# EAGLE board cape-servitron-v1 (EAGLE 6.4)
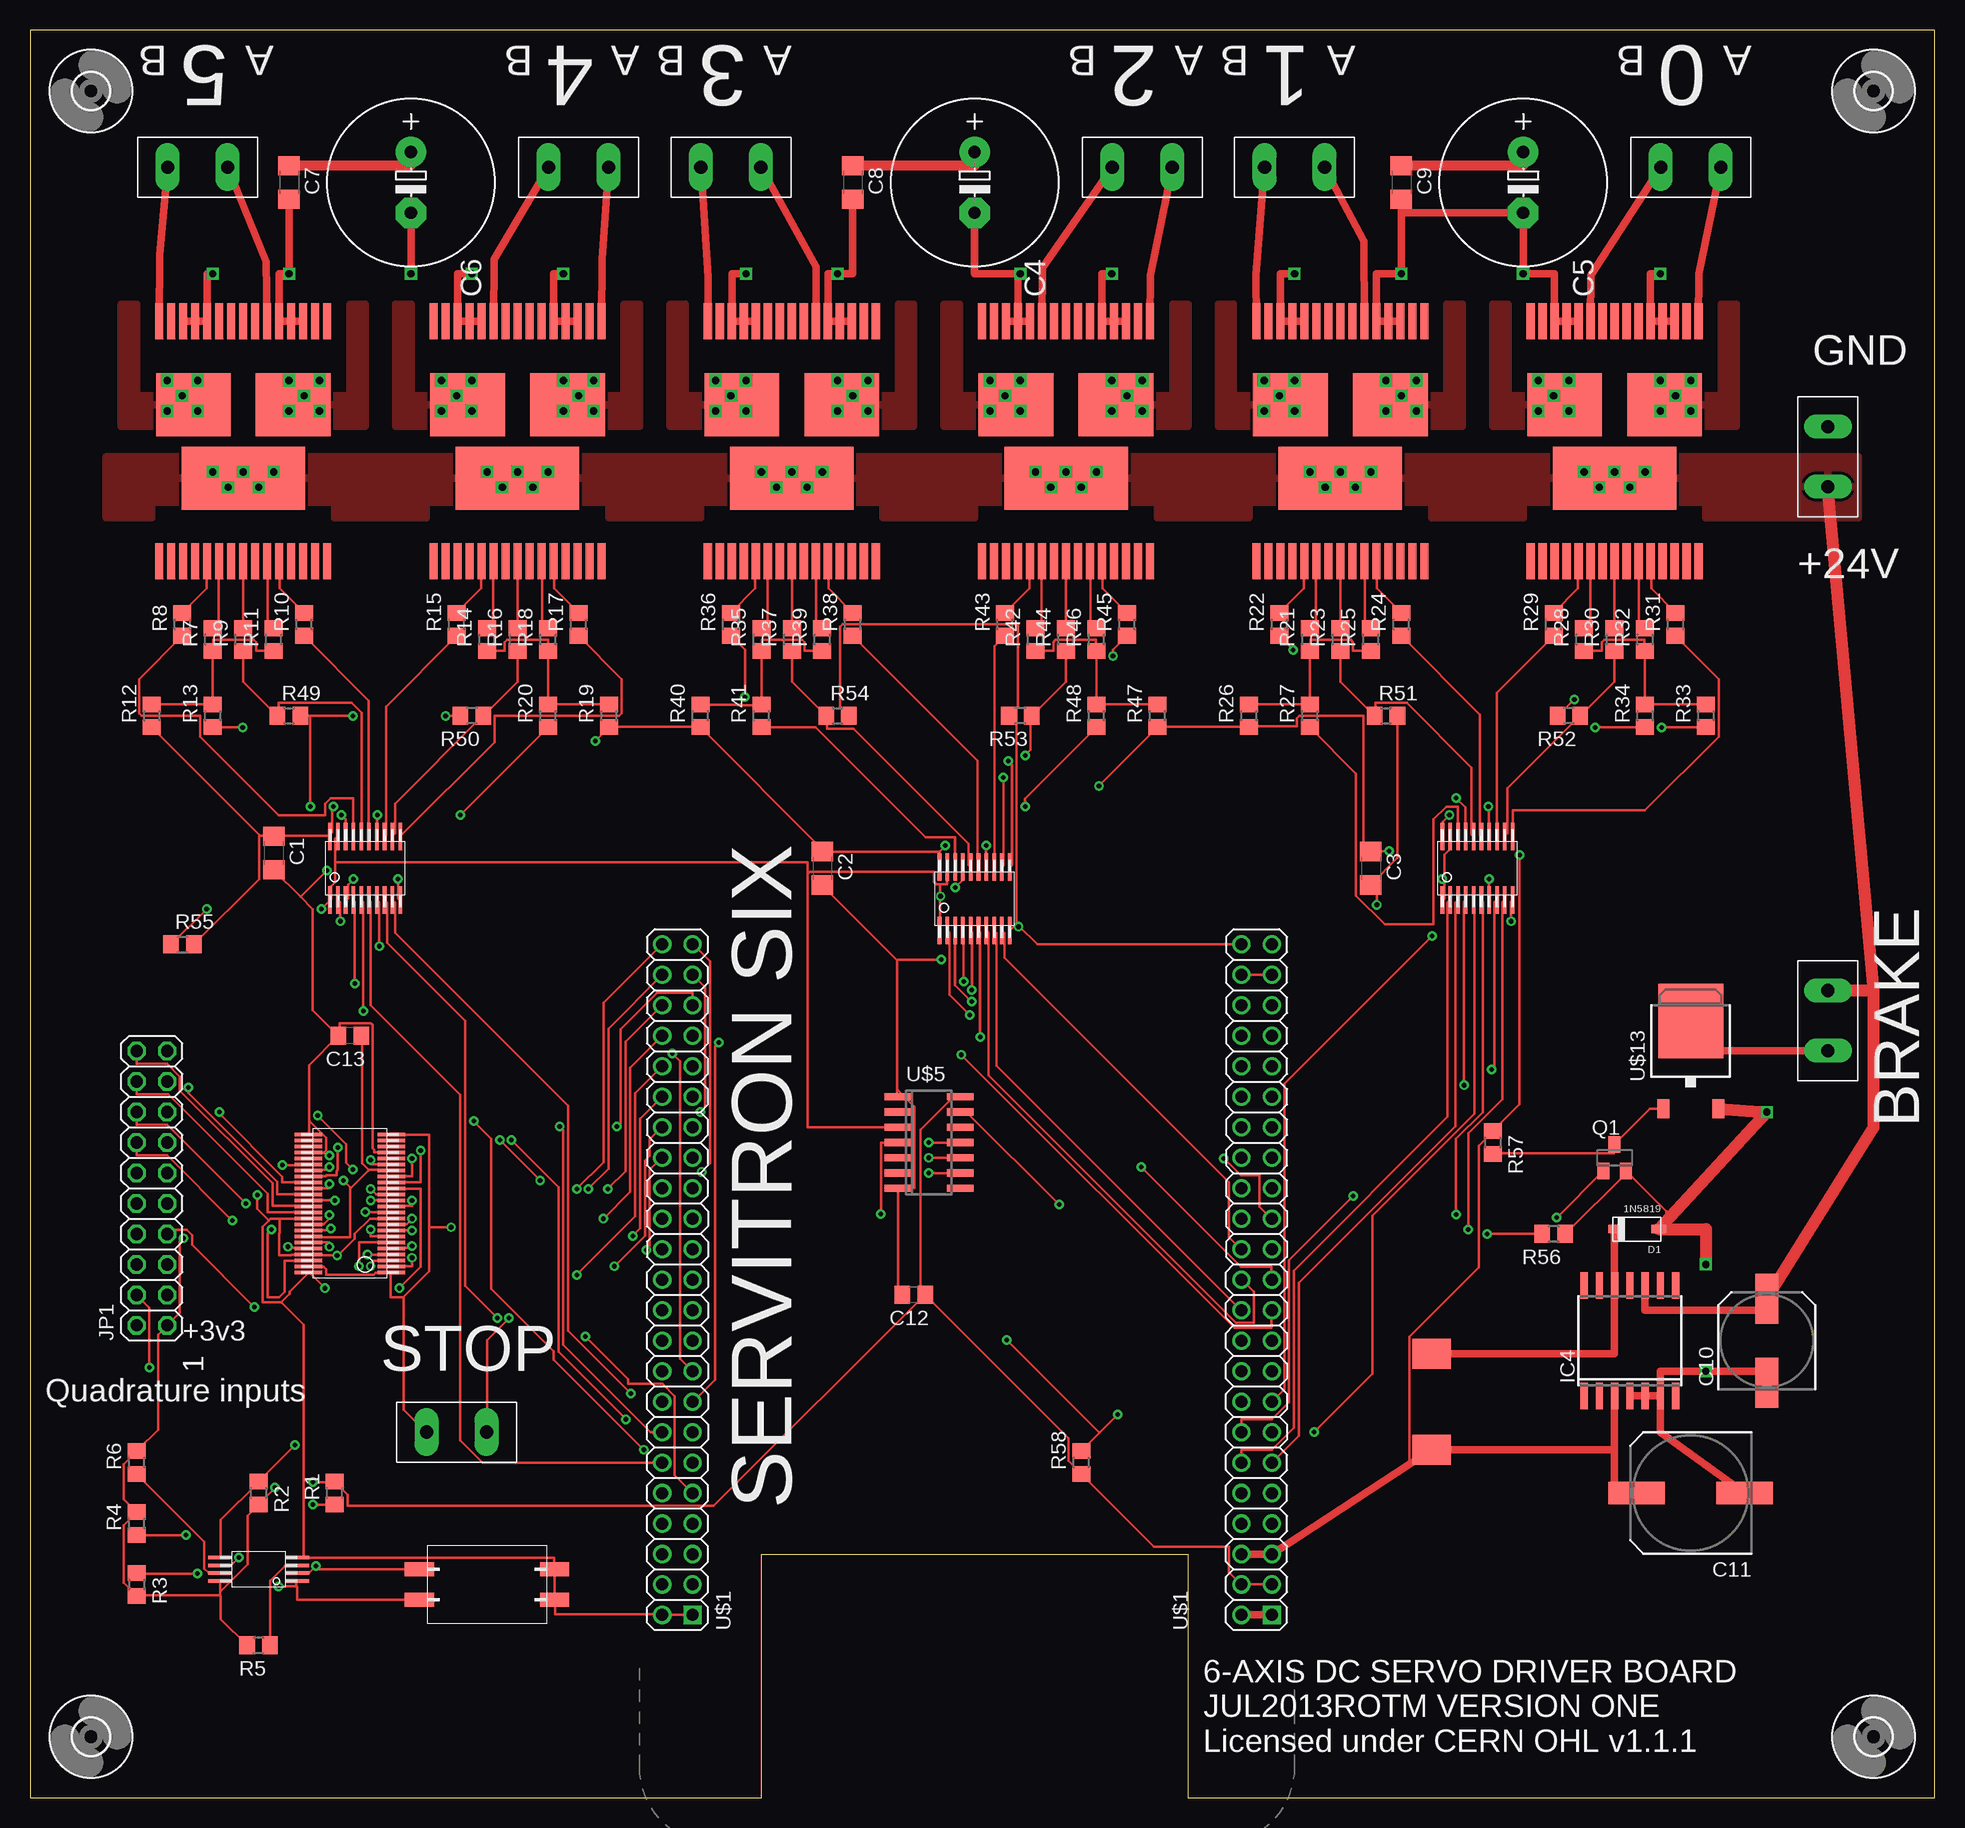
[diagram p4: board, top side]
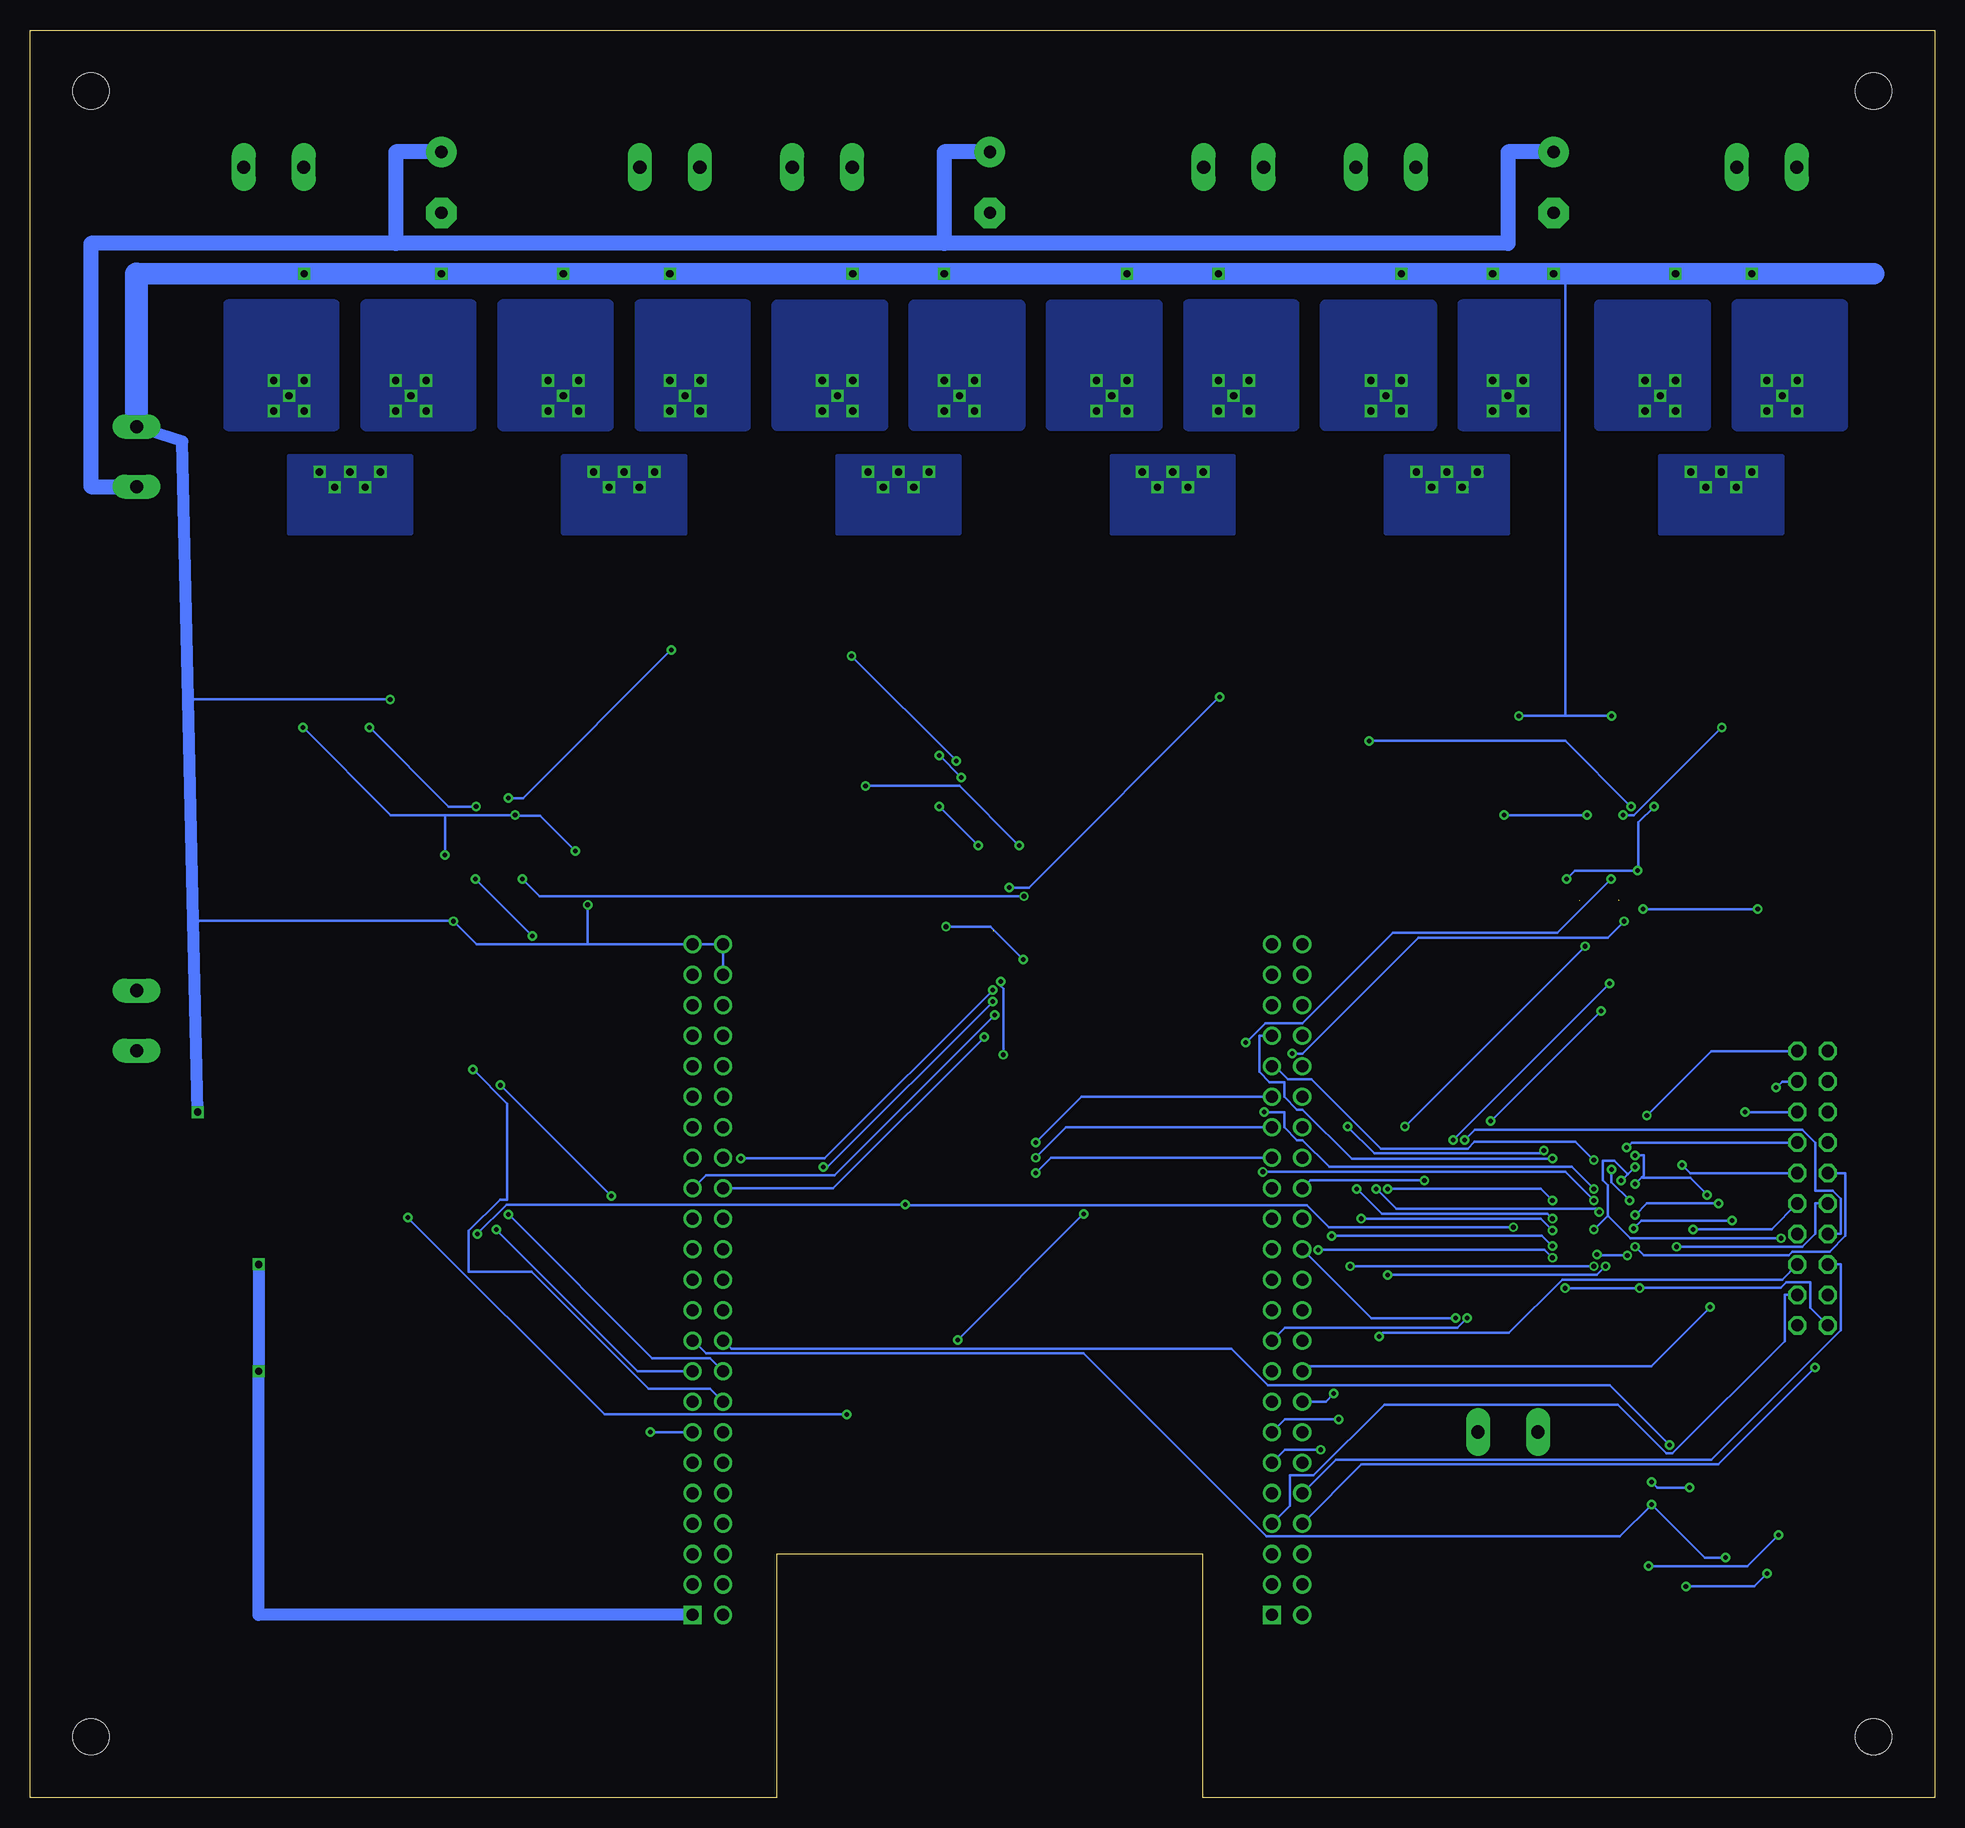
[diagram p5: board, bottom side, seen from below]

Size 158.75 x 147.32 mm. Coordinates in mm from the lower left corner, seen from the top.
Outline: 158.75,0 158.75,147.32 0,147.32 0,0 60.96,0 60.96,20.32 96.52,20.32 96.52,0 158.75,0
Copper layers (1*16): Top 0.0356mm / dielectric 63mil / Bottom 0.0356mm
Design rules "advanced *": minimum track width 6mil, minimum drill 15mil, track to track 6mil, track to pad 6mil, pad to pad 6mil, via to via 6mil, smd to smd 6mil, copper to edge 0mil, drill to drill 6mil, minimum pad ring 10mil, minimum via ring 8mil, stop-mask expansion 4mil, vias tented up to drill 0mil, thermal gap 10mil
Net classes: 1 Motor: width 0.5 mm, clearance 0.3 mm

## Footprints (pad centres in the part's own frame; a part is rotated, then mirrored left to right if it is on the bottom)
5MM-HEADER-2 = drill 1.1 pad 2 long: P$1 -2.5,0; P$2 2.5,0
C1206 = smd 1.6 x 1.8: 1 -1.4,0; 2 1.4,0
E5-13 = drill 1.016 pad 2.54: + -2.54,0 | drill 1.016 pad 2.54 octagon: - 2.54,0
SANYO-OSCON_SMD_E7 = smd 4.15 x 1.9: + 3.5,0; - -3.5,0
SANYO-OSCON_SMD_F8 = smd 4.7 x 1.9: + 4.5,0; - -4.5,0
C0805 = smd 1.3 x 1.5: 1 -0.95,0; 2 0.95,0
SOD-123 = smd 1.2 x 0.7: A -1.8,0; C 1.8,0
3,0 = hole 3: 0,0
TSSOP-20 = smd 0.3 x 2.3: 1 -2.925,-2.65; 2 -2.275,-2.65; 3 -1.625,-2.65; 4 -0.975,-2.65; 5 -0.325,-2.65; 6 0.325,-2.65; 7 0.975,-2.65; 8 1.625,-2.65; 9 2.275,-2.65; 10 2.925,-2.65; 11 2.925,2.65; 12 2.275,2.65; 13 1.625,2.65; 14 0.975,2.65; 15 0.325,2.65; 16 -0.325,2.65; 17 -0.975,2.65; 18 -1.625,2.65; 19 -2.275,2.65; 20 -2.925,2.65
SO14W = smd 0.6 x 2.2: 1 -3.81,-4.6; 2 -2.54,-4.6; 3 -1.27,-4.6; 4 0,-4.6; 5 1.27,-4.6; 6 2.54,-4.6; 7 3.81,-4.6; 8 3.81,4.6; 9 2.54,4.6; 10 1.27,4.6; 11 0,4.6; 12 -1.27,4.6; 13 -2.54,4.6; 14 -3.81,4.6
2X10 = drill 1.016 octagon: 1 -11.43,-1.27; 2 -11.43,1.27; 3 -8.89,-1.27; 4 -8.89,1.27; 5 -6.35,-1.27; 6 -6.35,1.27; 7 -3.81,-1.27; 8 -3.81,1.27; 9 -1.27,-1.27; 10 -1.27,1.27; 11 1.27,-1.27; 12 1.27,1.27; 13 3.81,-1.27; 14 3.81,1.27; 15 6.35,-1.27; 16 6.35,1.27; 17 8.89,-1.27; 18 8.89,1.27; 19 11.43,-1.27; 20 11.43,1.27
SMD10145 = smd 3.2 x 2.5: P$1 0,4; P$2 0,-4
SOT23 = smd 1 x 1.4: 1 -0.95,-1.1; 2 0.95,-1.1; 3 0,1.1
R0805 = smd 1.3 x 1.5: 1 -0.95,0; 2 0.95,0
BEAGLEBONE_SHIELD = drill 1 square: 1 4.445,19.05; 47 52.705,19.05 | drill 1: 2 1.905,19.05; 3 4.445,21.59; 4 1.905,21.59; 5 4.445,24.13; 6 1.905,24.13; 7 4.445,26.67; 8 1.905,26.67; 9 4.445,29.21; 10 1.905,29.21; 11 4.445,31.75; 12 1.905,31.75; 13 4.445,34.29; 14 1.905,34.29; 15 4.445,36.83; 16 1.905,36.83; 17 4.445,39.37; 18 1.905,39.37; 19 4.445,41.91; 20 1.905,41.91; 21 4.445,44.45; 22 1.905,44.45; 23 4.445,46.99; 24 1.905,46.99; 25 4.445,49.53; 26 1.905,49.53; 27 4.445,52.07; 28 1.905,52.07; 29 4.445,54.61; 30 1.905,54.61; 31 4.445,57.15; 32 1.905,57.15; 33 4.445,59.69; 34 1.905,59.69; 35 4.445,62.23; 36 1.905,62.23; 37 4.445,64.77; 38 1.905,64.77; 39 4.445,67.31; 40 1.905,67.31; 41 4.445,69.85; 42 1.905,69.85; 43 4.445,72.39; 44 1.905,72.39; 45 4.445,74.93; 46 1.905,74.93; 48 50.165,19.05; 49 52.705,21.59; 50 50.165,21.59; 51 52.705,24.13; 52 50.165,24.13; 53 52.705,26.67; 54 50.165,26.67; 55 52.705,29.21; 56 50.165,29.21; 57 52.705,31.75; 58 50.165,31.75; 59 52.705,34.29; 60 50.165,34.29; 61 52.705,36.83; 62 50.165,36.83; 63 52.705,39.37; 64 50.165,39.37; 65 52.705,41.91; 66 50.165,41.91; 67 52.705,44.45; 68 50.165,44.45; 69 52.705,46.99; 70 50.165,46.99; 71 52.705,49.53; 72 50.165,49.53; 73 52.705,52.07; 74 50.165,52.07; 75 52.705,54.61; 76 50.165,54.61; 77 52.705,57.15; 78 50.165,57.15; 79 52.705,59.69; 80 50.165,59.69; 81 52.705,62.23; 82 50.165,62.23; 83 52.705,64.77; 84 50.165,64.77; 85 52.705,67.31; 86 50.165,67.31; 87 52.705,69.85; 88 50.165,69.85; 89 52.705,72.39; 90 50.165,72.39; 91 52.705,74.93; 92 50.165,74.93
TSSOP-48 = smd 0.3 x 2.3: 1 -5.75,-3.45; 2 -5.25,-3.45; 3 -4.75,-3.45; 4 -4.25,-3.45; 5 -3.75,-3.45; 6 -3.25,-3.45; 7 -2.75,-3.45; 8 -2.25,-3.45; 9 -1.75,-3.45; 10 -1.25,-3.45; 11 -0.75,-3.45; 12 -0.25,-3.45; 13 0.25,-3.45; 14 0.75,-3.45; 15 1.25,-3.45; 16 1.75,-3.45; 17 2.25,-3.45; 18 2.75,-3.45; 19 3.25,-3.45; 20 3.75,-3.45; 21 4.25,-3.45; 22 4.75,-3.45; 23 5.25,-3.45; 24 5.75,-3.45; 25 5.75,3.45; 26 5.25,3.45; 27 4.75,3.45; 28 4.25,3.45; 29 3.75,3.45; 30 3.25,3.45; 31 2.75,3.45; 32 2.25,3.45; 33 1.75,3.45; 34 1.25,3.45; 35 0.75,3.45; 36 0.25,3.45; 37 -0.25,3.45; 38 -0.75,3.45; 39 -1.25,3.45; 40 -1.75,3.45; 41 -2.25,3.45; 42 -2.75,3.45; 43 -3.25,3.45; 44 -3.75,3.45; 45 -4.25,3.45; 46 -4.75,3.45; 47 -5.25,3.45; 48 -5.75,3.45
TSSOP-8 = smd 0.3 x 2: 1 -0.975,-3.2; 2 -0.325,-3.2; 3 0.325,-3.2; 4 0.975,-3.2; 5 0.975,3.2; 6 0.325,3.2; 7 -0.325,3.2; 8 -0.975,3.2
CT219-2 = smd 1.13 x 2.44: 1 -1.27,-5.635; 2 1.27,-5.635; 3 1.27,5.635; 4 -1.27,5.635
SO14 = smd 0.6 x 2.2: 1 -3.81,-2.6; 2 -2.54,-2.6; 3 -1.27,-2.6; 4 0,-2.6; 5 1.27,-2.6; 6 2.54,-2.6; 7 3.81,-2.6; 8 3.81,2.6; 9 2.54,2.6; 10 1.27,2.6; 11 0,2.6; 12 -1.27,2.6; 13 -2.54,2.6; 14 -3.81,2.6
MULTIPOWER-SO-30 = smd 0.68 x 3: P$1 -7,-10; P$2 -6,-10; P$3 -5,-10; P$4 -4,-10; P$5 -3,-10; P$6 -2,-10; P$7 -1,-10; P$8 0,-10; P$9 1,-10; P$10 2,-10; P$11 3,-10; P$12 4,-10; P$13 5,-10; P$14 6,-10; P$15 7,-10; P$16 7,10; P$17 6,10; P$18 5,10; P$19 4,10; P$20 3,10; P$21 2,10; P$22 1,10; P$23 0,10; P$24 -1,10; P$25 -2,10; P$26 -3,10; P$27 -4,10; P$28 -5,10; P$29 -6,10; P$30 -7,10 | smd 6.23 x 5.25: T$1 -4.165,3.05; T$2 4.165,3.05 | smd 10.3 x 5.25: T$3 0,-3.05
TO252 = smd 1 x 1.6: 1 -2.28,-4.8; 2 2.28,-4.8 | smd 5.4 x 6.2: 3 0,2.5

## Placement (x,y rotation side)
BRAKE  PINHEAD-5MM-1X2  [5MM-HEADER-2]  149.86,64.77 90 top
C1  [C1206]  20.32,78.74 270 top
C2  [C1206]  66.04,77.47 270 top
C3  [C1206]  111.76,77.47 270 top
C4  2700uF  [E5-13]  78.74,134.62 270 top
C5  2700uF  [E5-13]  124.46,134.62 270 top
C6  2700uF  [E5-13]  31.75,134.62 270 top
C7  [C1206]  21.59,134.62 270 top
C8  [C1206]  68.58,134.62 270 top
C9  [C1206]  114.3,134.62 270 top
C10  22uF  [SANYO-OSCON_SMD_E7]  144.78,38.1 90 top
C11  220uF  [SANYO-OSCON_SMD_F8]  138.43,25.4 180 top
C12  [C0805]  73.66,41.91 180 top
C13  [C0805]  26.67,63.5 180 top
D1  1N5819  [SOD-123]  133.95,47.39 180 top
ESTOP  PINHEAD-5MM-1X2  [5MM-HEADER-2]  35.56,30.48 180 top
H1  MOUNT-HOLE3.0  [3,0]  153.67,5.08 0 top
H2  MOUNT-HOLE3.0  [3,0]  5.08,5.08 0 top
H3  MOUNT-HOLE3.0  [3,0]  153.67,142.24 0 top
H4  MOUNT-HOLE3.0  [3,0]  5.08,142.24 0 top
IC1  74541PW  [TSSOP-20]  27.94,77.47 0 top
IC2  74541PW  [TSSOP-20]  120.65,77.47 0 top
IC3  74541PW  [TSSOP-20]  78.74,74.93 0 top
IC4  LM2574M-5.0  [SO14W]  133.35,38.1 0 top
JP1  [2X10]  10.16,50.8 90 top
L1  SLF10145  [SMD10145]  116.84,33.02 0 top
M0-CONN  PINHEAD-5MM-1X2  [5MM-HEADER-2]  13.97,135.89 0 top
M0-CONN1  PINHEAD-5MM-1X2  [5MM-HEADER-2]  45.72,135.89 0 top
M0-CONN2  PINHEAD-5MM-1X2  [5MM-HEADER-2]  105.41,135.89 0 top
M0-CONN3  PINHEAD-5MM-1X2  [5MM-HEADER-2]  138.43,135.89 0 top
M0-CONN4  PINHEAD-5MM-1X2  [5MM-HEADER-2]  58.42,135.89 0 top
M0-CONN5  PINHEAD-5MM-1X2  [5MM-HEADER-2]  92.71,135.89 0 top
POWER_IN  PINHEAD-5MM-1X2  [5MM-HEADER-2]  149.86,111.76 90 top
Q1  BSS123  [SOT23]  132.08,53.34 0 top
R1  5.6k  [R0805]  25.4,25.4 90 top
R2  5.6k  [R0805]  19.05,25.4 270 top
R3  4.75k  [R0805]  8.89,17.78 270 top
R4  4.75k  [R0805]  8.89,22.86 90 top
R5  4.75k  [R0805]  19.05,12.7 180 top
R6  DNP  [R0805]  8.89,27.94 90 top
R7  1K  [R0805]  15.24,96.52 90 top
R8  1K  [R0805]  12.7,97.79 90 top
R9  1K  [R0805]  17.78,96.52 90 top
R10  1K  [R0805]  22.86,97.79 90 top
R11  1K  [R0805]  20.32,96.52 90 top
R12  3.3K  [R0805]  10.16,90.17 90 top
R13  0  [R0805]  15.24,90.17 90 top
R14  1K  [R0805]  38.1,96.52 90 top
R15  1K  [R0805]  35.56,97.79 90 top
R16  1K  [R0805]  40.64,96.52 90 top
R17  1K  [R0805]  45.72,97.79 90 top
R18  1K  [R0805]  43.18,96.52 90 top
R19  3.3K  [R0805]  48.26,90.17 90 top
R20  0  [R0805]  43.18,90.17 90 top
R21  1K  [R0805]  106.68,96.52 90 top
R22  1K  [R0805]  104.14,97.79 90 top
R23  1K  [R0805]  109.22,96.52 90 top
R24  1K  [R0805]  114.3,97.79 90 top
R25  1K  [R0805]  111.76,96.52 90 top
R26  3.3K  [R0805]  101.6,90.17 90 top
R27  0  [R0805]  106.68,90.17 90 top
R28  1K  [R0805]  129.54,96.52 90 top
R29  1K  [R0805]  127,97.79 90 top
R30  1K  [R0805]  132.08,96.52 90 top
R31  1K  [R0805]  137.16,97.79 90 top
R32  1K  [R0805]  134.62,96.52 90 top
R33  3.3K  [R0805]  139.7,90.17 90 top
R34  0  [R0805]  134.62,90.17 90 top
R35  1K  [R0805]  60.96,96.52 90 top
R36  1K  [R0805]  58.42,97.79 90 top
R37  1K  [R0805]  63.5,96.52 90 top
R38  1K  [R0805]  68.58,97.79 90 top
R39  1K  [R0805]  66.04,96.52 90 top
R40  3.3K  [R0805]  55.88,90.17 90 top
R41  0  [R0805]  60.96,90.17 90 top
R42  1K  [R0805]  83.82,96.52 90 top
R43  1K  [R0805]  81.28,97.79 90 top
R44  1K  [R0805]  86.36,96.52 90 top
R45  1K  [R0805]  91.44,97.79 90 top
R46  1K  [R0805]  88.9,96.52 90 top
R47  3.3K  [R0805]  93.98,90.17 90 top
R48  0  [R0805]  88.9,90.17 90 top
R49  3.3K  [R0805]  21.59,90.17 0 top
R50  3.3K  [R0805]  36.83,90.17 180 top
R51  3.3K  [R0805]  113.03,90.17 0 top
R52  3.3K  [R0805]  128.27,90.17 180 top
R53  3.3K  [R0805]  82.55,90.17 180 top
R54  3.3K  [R0805]  67.31,90.17 0 top
R55  3.3K  [R0805]  12.7,71.12 0 top
R56  4.75K  [R0805]  127,46.99 180 top
R57  5.6K  [R0805]  121.92,54.61 270 top
R58  5.6K  [R0805]  87.63,27.94 90 top
U$1  BEAGLEBONE-BLACK  [BEAGLEBONE_SHIELD]  50.8,-3.81 0 top
U$2  74LCX16245  [TSSOP-48]  26.67,49.53 90 top
U$3  CAT24C2256Y  [TSSOP-8]  19.05,19.05 90 top
U$4  DIP-SW-2  [CT219-2]  38.1,17.78 90 top
U$5  74HC243D  [SO14]  74.93,54.61 270 top
U$6  VNH3SP30-E  [MULTIPOWER-SO-30]  17.78,113.03 0 top
U$7  VNH3SP30-E  [MULTIPOWER-SO-30]  40.64,113.03 0 top
U$8  VNH3SP30-E  [MULTIPOWER-SO-30]  109.22,113.03 0 top
U$9  VNH3SP30-E  [MULTIPOWER-SO-30]  132.08,113.03 0 top
U$10  VNH3SP30-E  [MULTIPOWER-SO-30]  63.5,113.03 0 top
U$11  VNH3SP30-E  [MULTIPOWER-SO-30]  86.36,113.03 0 top
U$13  IRFR3806  [TO252]  138.43,62.23 0 top

## Tracks (layer width: path | path; a pad name or v marks a point on that pad's centre or on a via)
!MALL-EN  (via drill 0.38)
  Top 0.203: v14.73,74.07 11.79,71.12 R55.1 | v24.28,74.07 24.99,74.78 IC1.1 25.09,74.88 25.09,75.95 25.45,76.3 25.45,77.98 | 25.45,77.98 25.45,79.91 25.65,80.11 IC1.19 | 117.91,76.56 117.91,78.59 118.36,79.05 118.36,80.11 IC2.19 | 117.91,76.56 117.91,74.98 117.75,74.83 IC2.1 | 64.87,77.01 65.02,77.17 75.34,77.17 75.34,76.35 75.54,76.15 75.84,76.15 | 64.87,77.01 64.82,76.96 64.82,55.88 72.29,55.88 U$5.3 | 75.84,76.15 76.45,76.15 IC3.19 | 75.84,75.13 75.84,76.1 75.84,76.15 | 75.84,75.13 75.84,72.29 IC3.1 | v117.7,76.56 117.86,76.56 117.91,76.56 | v75.89,75.13 75.84,75.13 | 25.45,77.98 25.5,77.98 64.82,77.98 64.82,77.06 64.87,77.01
  Bottom 0.203: v24.28,74.07 v14.73,74.07 | v117.7,76.56 116.28,75.13 v75.89,75.13
+3V3  (via drill 0.38)
  Top 0.203: C12.1 74.57,41.91 74.22,42.27 74.22,55.68 76.96,58.42 U$5.14 | U$1.49 103.48,17.78 101.04,17.78 U$1.50 100.94,17.78 99.92,18.8 99.92,20.93 93.67,20.93 87.63,26.98 R58.1 87.58,27.08 86.56,28.09 86.56,29.97 74.68,41.86 C12.1 | 28.25,52.32 27.69,52.88 27.69,63.45 27.64,63.5 C13.1 | 28.25,52.32 30.07,52.32 U$2.18 | 26.72,50.8 28.19,52.27 28.25,52.32 | 26.72,50.8 26.67,50.75 26.67,46.74 23.27,46.74 U$2.42 | v24.94,52.58 24.94,52.32 23.27,52.32 U$2.31 | v26.11,51.46 26.67,50.9 26.67,50.85 26.72,50.8 | v28.4,47.35 28.4,46.79 30.07,46.79 U$2.7 | 15.85,16.87 8.89,16.87 R3.2 8.84,16.92 7.82,17.93 7.82,22.71 8.84,23.72 R4.2 8.89,23.82 7.82,24.89 7.82,27.79 8.89,28.85 R6.2 8.94,28.96 10.67,30.68 10.67,38.61 JP1.1 11.48,39.42 12.5,40.44 12.5,46.33 v12.8,46.63 | 15.85,17.22 15.85,18.03 U$3.8 | 15.85,17.22 15.85,16.87 | R5.2 18.09,12.7 15.9,14.88 15.9,16.82 15.85,16.87 | 15.85,17.22 15.9,17.22 18.14,19.46 18.14,23.52 19.05,24.43 R2.2 19.1,24.54 v20.42,25.86 | v23.57,26.31 25.4,26.31 R1.2 25.45,26.26 26.47,25.25 26.47,24.33 57,24.33 74.52,41.86 C12.1
  Bottom 0.203: 25.55,51.97 26.06,51.46 v26.11,51.46 | 25.55,51.97 v24.94,52.58 | 27.23,48.51 v28.4,47.35 | 27.23,48.51 27.23,51.05 27.64,51.46 27.64,53.09 26.67,53.09 25.6,52.02 25.55,51.97 | v23.57,26.31 23.11,25.86 v20.42,25.86 | v12.8,46.63 25.35,46.63 27.18,48.46 27.23,48.51
+24V  (via drill 0.6)
  Top 0.61: IC4.10 134.62,40.64 144.78,40.64 C10.+
  Top 0.813: C6.+ 31.75,136.02 C7.1 | C4.+ 78.74,136.02 C8.1 | C5.+ 124.46,136.02 C9.1
  Top 1.016: C10.+ 153.67,55.88 153.67,67.31 | 153.67,67.31 BRAKE.P$2 153.67,67.31 | 153.67,67.31 POWER_IN.P$1
  Bottom 1.27: C5.+ 128.27,137.16 128.27,129.54 | 128.27,129.54 153.67,129.54 153.67,109.26 POWER_IN.P$1 | C4.+ 82.55,137.16 82.55,129.54 | 82.55,129.54 128.27,129.54 | C6.+ 35.56,137.16 35.56,129.54 82.55,129.54
  other vias: 20.32,110.49 19.05,109.22 17.78,110.49 16.51,109.22 15.24,110.49 43.18,110.49 41.91,109.22 40.64,110.49 39.37,109.22 38.1,110.49 60.96,110.49 62.23,109.22 63.5,110.49 66.04,110.49 64.77,109.22 83.82,110.49 85.09,109.22 86.36,110.49 87.63,109.22 88.9,110.49 106.68,110.49 107.95,109.22 109.22,110.49 110.49,109.22 111.76,110.49 129.54,110.49 132.08,110.49 134.62,110.49 130.81,109.22 133.35,109.22
  pour Top: 6.35,106.68 10.16,106.68 10.16,107.95 25.4,107.95 25.4,106.68 33.02,106.68 33.02,107.95 48.26,107.95 48.26,106.68 55.88,106.68 55.88,107.95 71.12,107.95 71.12,106.68 78.74,106.68 78.74,107.95 93.98,107.95 93.98,106.68 101.6,106.68 101.6,107.95 116.84,107.95 116.84,106.68 124.46,106.68 124.46,107.95 139.7,107.95 139.7,106.68 152.4,106.68 152.4,111.76 6.35,111.76
  pour Bottom: 35.56,111.76 45.72,111.76 45.72,105.41 35.56,105.41
  pour Bottom: 58.42,111.76 68.58,111.76 68.58,105.41 58.42,105.41
  pour Bottom: 81.28,111.76 91.44,111.76 91.44,105.41 81.28,105.41
  pour Bottom: 104.14,111.76 114.3,111.76 114.3,105.41 104.14,105.41
  pour Bottom: 127,111.76 137.16,111.76 137.16,105.41 127,105.41
  pour Bottom: 12.7,111.76 22.86,111.76 22.86,105.41 12.7,105.41
BRAKE  (via drill 0.38)
  Top 0.203: v127.25,48.36 131.12,52.22 Q1.1 | 89.15,30.43 87.63,28.91 R58.2 | 89.15,30.43 v90.68,31.95 | v70.92,48.67 70.92,54.61 72.29,54.61 U$5.4 | v81.43,38.15 89.1,30.48 89.15,30.43
  Bottom 0.203: v127.25,48.36 110.85,31.95 v90.68,31.95 | v81.43,38.15 v70.92,48.67
EN_BUFFERS  (via drill 0.38)
  Top 0.203: U$2.47 23.27,44.25 24.49,44.25 24.69,44.04 24.69,43.59 28.65,43.59 28.8,43.74 30.07,43.74 U$2.1 30.07,43.64 30.07,41.71 31.09,41.71 | 33.27,47.55 33.27,43.89 31.09,41.71 | 33.27,47.55 33.27,55.27 U$2.24 | ESTOP.P$2 33.02,30.48 31.14,32.36 31.14,41.66 31.09,41.71 | v121.46,46.99 126.03,46.99 R56.2 | v85.8,49.43 78.08,57.15 77.57,57.15 U$5.13 | v35.1,47.55 33.33,47.55 33.27,47.55
  Bottom 0.203: v121.46,46.99 119.02,49.43 v85.8,49.43 85.75,49.38 52.32,49.38 50.49,47.55 v35.1,47.55
GND  (via drill 0.38, 0.6)
  Top 0.203: U$1.1 55.22,15.24 52.73,15.24 U$1.2 52.63,15.29 43.79,15.29 43.79,16.46 U$4.1 43.74,19 U$4.2 43.69,19.05 43.69,20.02 22.25,20.02 U$3.4 22.81,20.07 22.81,39.42 20.98,41.25 20.93,41.3 | 20.93,41.3 21.64,42.01 21.64,42.16 23.22,43.74 U$2.48 23.32,43.74 v24.59,42.47 | 20.93,41.3 19.41,41.3 19.41,47.6 19.91,48.11 | 19.91,48.11 20.07,48.26 20.83,48.26 | 20.83,48.26 23.22,48.26 U$2.39 | 20.83,48.26 20.83,48.21 20.83,47.09 20.78,47.04 20.78,45.21 21.74,45.21 21.79,45.26 23.22,45.26 U$2.45 23.27,45.21 v25.6,45.21 25.65,45.16 27.08,46.58 27.08,46.99 28.35,48.26 30.07,48.26 U$2.10 | v28.14,45.26 30.07,45.26 U$2.4 | v30.79,42.47 32.56,44.25 32.56,50.75 30.12,50.75 U$2.15 | v26.92,90.17 23.37,90.17 | 23.37,90.17 22.55,90.17 R49.2 | v34.65,90.17 35.87,90.17 R50.2 | v24.94,51.16 24.94,50.8 23.27,50.8 U$2.34 | v24.94,53.54 24.69,53.54 24.49,53.75 | 24.49,53.75 23.27,53.75 U$2.28 | 23.27,56.39 23.27,55.32 U$2.25 | 23.27,56.39 23.27,61.06 25.7,63.5 C13.2 | 22.55,75.08 23.57,74.07 23.57,65.63 25.65,63.55 C13.2 | 22.55,75.08 20.32,77.32 C1.2 | U$2.21 30.07,53.8 28.7,53.8 28.7,54 28.55,54.15 28.55,64.41 28.4,64.57 25.81,64.57 25.81,63.55 C13.2 | v30.68,76.56 30.68,74.98 30.84,74.83 IC1.10 | v24.74,77.27 22.61,75.13 22.55,75.08 | 24.49,53.75 24.54,53.8 24.69,53.95 24.69,55.02 23.32,56.39 23.27,56.39 | v23.37,82.6 23.37,90.12 23.37,90.17 | v18.95,50.24 18.95,49.07 19.86,48.16 19.91,48.11 | 136.76,48.48 136.4,48.82 136.4,48.87 133.04,52.22 Q1.2 133.04,52.12 133.04,52.07 127.97,46.99 R56.1 | v128.73,91.54 127.36,90.17 R52.2 | C12.2 72.69,41.91 72.34,42.27 U$5.7 72.39,50.85 73.71,50.85 73.71,57.61 72.34,58.98 72.29,58.98
  Top 0.203: 72.29,69.8 66.04,76.05 C2.2 | 72.29,58.98 72.29,58.42 U$5.1 | 72.29,58.98 72.29,69.8 | R54.2 68.22,90.17 67.51,90.88 67.51,97.59 67.72,97.79 82.35,97.79 82.35,90.88 81.64,90.17 R53.2 82.25,90.68 82.25,72.85 | 82.25,72.85 81.69,72.29 IC3.10 | R51.2 114,90.17 114,78.33 111.76,76.1 C3.2 111.81,76 112.27,75.54 v112.27,74.42 | U$1.90 100.99,68.58 103.48,68.58 U$1.89 | v123.44,73.05 123.44,74.68 123.55,74.78 IC2.10 | 82.45,72.64 83.97,71.12 100.94,71.12 U$1.92 | 82.45,72.64 82.3,72.8 82.25,72.85 | v75.95,69.85 72.34,69.85 72.29,69.8 | v82.4,72.59 82.45,72.64
  Top 0.61: U$6.P$18 U$6.P$19 U$6.P$20 20.78,127 v21.59,127 C7.2 | U$6.P$28 U$6.P$27 U$6.P$26 14.78,127 v15.24,127 | U$7.P$26 U$7.P$27 U$7.P$28 35.64,127 v36.83,127 | U$7.P$18 U$7.P$19 U$7.P$20 43.64,127 v44.45,127 | U$10.P$26 U$10.P$27 U$10.P$28 58.5,127 v59.69,127 | U$10.P$18 U$10.P$19 U$10.P$20 66.5,127 v67.31,127 68.58,127 C8.2 | U$11.P$28 U$11.P$27 | U$11.P$26 U$11.P$27 | U$11.P$18 U$11.P$19 U$11.P$20 89.36,127 v90.17,127 | U$8.P$26 U$8.P$27 U$8.P$28 104.22,127 v105.41,127 | U$8.P$18 U$8.P$19 U$8.P$20 112.22,127 v114.3,127 C9.2 114.3,132.08 C5.- v124.46,127 127.08,127 U$9.P$28 U$9.P$27 U$9.P$26 | U$9.P$18 U$9.P$19 U$9.P$20 135.08,127 v135.89,127 | C6.- v31.75,127 | C4.- 78.74,127 v82.55,127 82.36,127 U$11.P$27 | IC4.6 135.89,35.56 138.43,35.56 | 138.43,35.56 v139.7,35.56 | v139.7,35.56 144.78,35.56 C10.- | IC4.6 135.89,30.48 C11.- | IC4.6 IC4.5 IC4.4 | v139.7,35.56 138.43,35.56 | U$1.48 U$1.47
  Top 1.016: v139.7,44.45 139.7,47.39 D1.A 136.76,48.48 v144.78,57.15 U$13.2
  Bottom 0.203: v28.14,45.26 28.09,45.21 v25.6,45.21 | v30.79,42.47 v24.59,42.47 24.54,42.52 12.8,42.52 12.34,42.98 10.36,42.98 10.36,40.84 JP1.2 | v34.65,90.17 30.79,90.17 | 30.79,90.17 v26.92,90.17 | 24.38,51.71 24.23,51.87 24.23,53.54 v24.94,53.54 | 24.38,51.71 v24.94,51.16 | v30.68,76.56 29.97,77.27 v24.74,77.27 24.69,77.32 24.69,81.28 v23.37,82.6 | v18.95,50.24 20.37,51.66 24.33,51.66 24.38,51.71 | v128.73,91.54 145.09,91.54 145.56,91.53 | 112.27,71.12 103.53,71.12 U$1.91 103.43,71.12 100.99,71.12 U$1.92 100.99,71.07 100.99,68.58 U$1.90 | 112.27,71.12 121.51,71.12 v123.44,73.05 123.5,73.1 144.68,73.1 145.14,73.09 | v112.27,74.42 112.27,71.17 112.27,71.12 | v75.95,69.85 78.69,72.59 v82.4,72.59 | 30.79,90.17 30.79,90.22 30.79,126.14 30.79,127
  Bottom 0.61: v15.24,127 16.51,127 | v21.59,127 22.86,127 | v31.75,127 33.02,127 | v36.83,127 38.1,127 | v44.45,127 45.72,127 | v59.69,127 60.96,127 | v67.31,127 68.58,127 | v82.55,127 83.82,127 | v90.17,127 91.44,127 | v105.41,127 106.68,127 | v114.3,127 115.57,127 | v124.46,127 125.73,127 | v135.89,127 137.16,127
  Bottom 1.016: v139.7,44.45 v139.7,35.56 139.7,15.24 U$1.47 | v144.78,57.15 145.14,73.09 145.56,91.53 146.05,113.03 POWER_IN.P$2
  Bottom 1.778: 149.86,127 137.16,127 v135.89,127 125.73,127 v124.46,127 115.57,127 v114.3,127 106.68,127 v105.41,127 91.44,127 v90.17,127 83.82,127 v82.55,127 68.58,127 v67.31,127 60.96,127 v59.69,127 45.72,127 v44.45,127 38.1,127 v36.83,127 33.02,127 v31.75,127 30.79,127 22.86,127 v21.59,127 16.51,127 v15.24,127 5.08,127
  Bottom 1.93: POWER_IN.P$2 149.86,127
GPIO0_8  (via drill 0.38)
  Top 0.203: v74.93,54.61 U$5.11
  Bottom 0.203: v74.93,54.61 71.12,58.42 55.27,58.42 U$1.35
GPIO0_9  (via drill 0.38)
  Top 0.203: v74.93,53.34 U$5.10
  Bottom 0.203: v74.93,53.34 72.39,55.88 55.27,55.88 U$1.33
GPIO0_10  (via drill 0.38)
  Top 0.203: v74.93,52.07 U$5.9
  Bottom 0.203: v74.93,52.07 73.66,53.34 55.27,53.34 U$1.31
I2C2_SCL  (via drill 0.38)
  Top 0.203: v23.57,24.43 25.4,24.43 R1.1 | v17.42,20.02 16.82,19.41 15.9,19.41 U$3.6
  Bottom 0.203: v17.42,20.02 19.15,20.02 v23.57,24.43 23.62,24.38 26.21,21.79 55.68,21.79 70.92,37.03 102.41,37.03 103.48,38.1 U$1.65
I2C2_SDA  (via drill 0.38)
  Top 0.203: U$3.5 15.9,20.07 15.9,23.16 19.05,26.31 R2.1 19.1,26.42 v22.1,29.41
  Bottom 0.203: v22.1,29.41 27.08,34.39 55.58,34.39 58.62,37.44 100.28,37.44 100.94,38.1 U$1.66
M0_A  (via drill 0.38)
  Top 0.203: v119.89,47.35 119.89,55.37 122.73,58.22 122.73,74.62 122.89,74.78 IC2.9
  Bottom 0.203: v119.89,47.35 108.1,35.56 103.53,35.56 U$1.63
M0_B  (via drill 0.38)
  Top 0.203: v121.61,76.56 IC2.7 | v116.89,71.83 104.55,59.49 104.55,34.04 103.53,33.02 U$1.61
  Bottom 0.203: v116.89,71.83 v121.61,76.56
M0_EN  (via drill 0.38)
  Top 0.203: v118.87,48.62 118.87,54.91 121.11,57.15 121.11,74.68 121.01,74.78 IC2.6
  Bottom 0.203: v118.87,48.62 106.88,36.63 102.06,36.63 100.99,35.56 U$1.64
M0_PWM  (via drill 0.38)
  Top 0.203: v121.82,60.71 122.07,60.96 122.07,74.62 122.22,74.78 IC2.8
  Bottom 0.203: v121.82,60.71 118.97,57.86 118.97,49.84 119.58,49.84 122.17,47.24 122.17,43.84 116.94,43.84 107.19,34.09 102.06,34.09 100.99,33.02 U$1.62
M1_A  (via drill 0.38)
  Top 0.203: v107.04,30.48 111.91,35.36 111.91,48.51 120.4,57 120.4,74.73 120.34,74.78 IC2.5
  Bottom 0.203: v107.04,30.48 103.53,30.48 U$1.59
M1_B
  Top 0.203: IC2.3 119.02,74.78 118.82,74.57 118.82,55.98 105.77,42.93 105.77,30.18 103.53,27.94 U$1.57
M1_EN
  Top 0.203: IC2.2 118.36,74.78 118.16,74.57 118.16,56.74 105.36,43.94 105.36,30.84 103.53,29.01 100.99,29.01 100.99,27.94 U$1.58
M1_PWM  (via drill 0.38)
  Top 0.203: v119.53,59.38 119.53,74.68 119.63,74.78 IC2.4 | v110.29,50.14 104.95,44.81 104.95,32.97 103.53,31.55 100.99,31.55 100.99,30.48 U$1.60
  Bottom 0.203: v110.29,50.14 v119.53,59.38
M2_A
  Top 0.203: IC3.9 81.03,72.24 81.23,72.03 81.23,70 99.92,51.31 99.92,46.74 100.94,45.72 U$1.72
M2_B
  Top 0.203: IC3.7 79.76,72.24 79.91,72.08 79.91,60.2 100.53,39.57 102.01,39.57 102.01,42.16 100.99,43.18 U$1.70
M2_EN  (via drill 0.38)
  Top 0.203: v79.2,63.4 79.2,72.14 79.1,72.24 IC3.6
  Bottom 0.203: v79.2,63.4 91.8,50.8 100.94,50.8 U$1.76
M2_PWM
  Top 0.203: IC3.8 80.37,72.24 80.57,72.03 80.57,61.01 100.94,40.64 U$1.68
M3_A  (via drill 0.38)  (1 unrouted)
  Top 0.203: 78.44,72.24 78.54,72.14 78.54,67.36 v78.49,67.31 | v99.52,53.29 100.94,51.87 102.46,51.87 102.46,49.28 103.48,48.26 U$1.73
  Bottom 0.203: v78.49,67.31 92.51,53.29 v99.52,53.29
M3_B  (via drill 0.38)
  Top 0.203: v78.49,66.34 77.11,67.72 77.11,72.24 IC3.3 | v92.61,52.58 100.94,44.25 103.48,44.25 103.48,43.18 U$1.69
  Bottom 0.203: v78.49,66.34 92.25,52.58 v92.61,52.58
M3_EN  (via drill 0.38)
  Top 0.203: v78.33,65.23 76.66,66.9 76.66,72.08 76.5,72.24 IC3.2
  Bottom 0.203: v78.33,65.23 91.69,51.87 102.41,51.87 103.48,50.8 U$1.75
M3_PWM  (via drill 0.38)
  Top 0.203: v77.83,68.02 77.83,72.19 77.78,72.24 IC3.4 | v77.62,61.92 100.38,39.17 103.48,39.17 103.48,40.64 U$1.67
  Bottom 0.203: v77.83,68.02 77.83,67.61 77.62,67.41 v77.62,61.92
M4_A  (via drill 0.38)
  Top 0.203: v50.09,33.68 44.86,38.91 44.86,57.66 30.43,72.08 30.43,74.57 30.23,74.78 IC1.9
  Bottom 0.203: v50.09,33.68 50.75,33.02 52.68,33.02 U$1.16
M4_B  (via drill 0.38)
  Top 0.203: v29.11,70.97 29.11,74.62 28.96,74.78 IC1.7 | v44.15,55.93 44.45,55.63 44.45,37.74 51.71,30.48 52.68,30.48 U$1.14
  Bottom 0.203: v44.15,55.93 v29.11,70.97
M4_EN
  Top 0.203: IC1.6 28.3,74.78 28.4,74.68 28.4,66.04 35.87,58.57 35.87,29.82 37.74,27.94 52.68,27.94 U$1.12
M4_PWM  (via drill 0.38)  (1 unrouted)
  Top 0.203: 29.57,74.78 29.77,74.57 29.77,71.27 36.27,64.77 36.27,42.67 v38.96,39.98
  Bottom 0.203: v38.96,39.98 39.78,39.17 54.15,39.17 55.22,38.1 U$1.19
M5_A  (via drill 0.38)
  Top 0.203: v27.79,65.58 27.79,74.62 27.64,74.78 IC1.5 | v36.98,56.39 38.46,54.91 38.46,42.42 43.64,37.24 43.64,36.52 v51.16,29.01
  Bottom 0.203: v36.98,56.39 v27.79,65.58 | v51.16,29.01 54.15,29.01 55.22,27.94 U$1.11
M5_B  (via drill 0.38)  (1 unrouted)
  Top 0.203: 26.36,74.83 26.52,74.98 26.52,76.1 v26.98,76.56 | v57.4,62.94 57.1,62.64 57.1,34.85 55.27,33.02 U$1.15
  Bottom 0.203: v26.98,76.56 31.45,72.08 45.16,72.08 52.68,64.57 55.78,64.57 v57.4,62.94
M5_EN  (via drill 0.38)
  Top 0.203: v25.86,73.05 25.86,74.62 25.7,74.78 IC1.2 | v53.54,62.03 54.2,61.37 54.2,36.58 55.22,35.56 U$1.17
  Bottom 0.203: v25.86,73.05 27.23,71.68 43.03,71.68 52.68,62.03 v53.54,62.03
M5_PWM  (via drill 0.38)
  Top 0.203: v27.08,67.87 27.08,74.68 26.98,74.78 IC1.4 | v40.13,54.81 44.04,50.9 44.04,37.19 v49.68,31.55
  Bottom 0.203: v40.13,54.81 v27.08,67.87 | v49.68,31.55 54.15,31.55 55.22,30.48 U$1.13
N$1  (via drill 0.38)
  Top 0.203: v28.4,49.78 30.07,49.78 U$2.13 | v55.98,52.17 56.69,52.88 56.69,69.7 55.27,71.12 U$1.45
  Bottom 0.203: v28.4,49.78 30.79,52.17 v55.98,52.17
N$2  (via drill 0.38)
  Top 0.203: v31.85,49.78 31.85,49.33 30.12,49.33 U$2.12 | v45.57,50.75 47.8,52.98 47.8,66.24 52.68,71.12 U$1.46
  Bottom 0.203: v31.85,49.78 32.82,50.75 v45.57,50.75
N$3  (via drill 0.38)
  Top 0.203: v28.4,50.75 28.85,50.29 30.07,50.29 U$2.14 | v55.88,57.15 56.29,57.56 56.29,67.56 55.27,68.58 U$1.43
  Bottom 0.203: v28.4,50.75 30.23,52.58 50.44,52.58 52.68,54.81 53.14,54.81 54.2,55.88 54.2,57.15 v55.88,57.15
N$4  (via drill 0.38)
  Top 0.203: v27.94,48.82 30.07,48.82 U$2.11 | v46.53,50.75 48.21,52.43 48.21,64.11 52.68,68.58 U$1.44
  Bottom 0.203: v27.94,48.82 28.19,49.07 44.86,49.07 v46.53,50.75
N$5  (via drill 0.38)
  Top 0.203: v32.56,53.95 32.56,51.31 30.12,51.31 U$2.16 | v48.92,55.93 49.23,56.24 49.23,64.06 52.27,67.11 55.22,67.11 55.22,66.04 U$1.41
  Bottom 0.203: v32.56,53.95 32.82,53.7 46.69,53.7 v48.92,55.93
N$6  (via drill 0.38)
  Top 0.203: v31.85,48.26 31.39,47.8 30.12,47.8 U$2.9 | v48.16,50.75 49.63,52.22 49.63,62.99 52.68,66.04 U$1.42
  Bottom 0.203: v31.85,48.26 32.26,48.67 46.08,48.67 v48.16,50.75
N$7  (via drill 0.38)
  Top 0.203: v31.85,47.3 30.12,47.3 U$2.8 | v47.8,48.26 50.04,50.49 50.04,60.86 52.68,63.5 U$1.40
  Bottom 0.203: v31.85,47.3 32.82,48.26 v47.8,48.26
N$8  (via drill 0.38)
  Top 0.203: v31.85,53.29 31.85,51.82 30.12,51.82 U$2.17
  Bottom 0.203: v31.85,53.29 31.9,53.24 48.56,53.24 52.68,57.35 53.14,57.35 54.2,58.42 54.2,59.64 55.42,59.64 56.29,60.5 56.29,63.5 55.27,63.5 U$1.39
N$9  (via drill 0.38)
  Top 0.203: v28.4,53.14 28.4,52.78 30.07,52.78 U$2.19
  Bottom 0.203: v28.4,53.14 29.92,54.66 38.35,54.66 38.91,54.1 46.13,54.1 51.92,59.89 53.9,59.89 54.97,60.96 55.22,60.96 U$1.37
N$10  (via drill 0.38)
  Top 0.203: v27.43,44.3 27.43,46.28 30.07,46.28 U$2.6 | v45.57,43.59 50.44,48.46 50.44,58.73 52.68,60.96 U$1.38
  Bottom 0.203: v27.43,44.3 28.14,43.59 v45.57,43.59
N$11
  Top 0.203: R7.2 15.24,97.48 15.75,97.99 15.75,103.02 U$6.P$6
N$12
  Top 0.203: R12.2 10.16,91.14 15.24,91.14 R13.2 15.24,91.19 15.24,95.56 R7.1 15.29,95.66 15.29,96.52 18.64,96.52 18.85,96.32 18.85,95.61 20.32,95.61 R11.1
N$13  (via drill 0.38)
  Top 0.203: v17.73,89.2 15.24,89.2 R13.1 | v25.96,81.89 26.31,81.53 26.31,80.16 IC1.18
  Bottom 0.203: v17.73,89.2 25.04,81.89 v25.96,81.89
N$14  (via drill 0.38)
  Top 0.203: v31.85,45.97 31.85,45.82 30.12,45.82 U$2.5 | v50.24,46.84 50.85,47.45 50.85,56.59 52.68,58.42 U$1.36
  Bottom 0.203: v31.85,45.97 32.72,46.84 v50.24,46.84
N$15  (via drill 0.38)
  Top 0.203: v28.4,44.3 28.6,44.5 28.6,44.76 30.07,44.76 U$2.3 | v48.72,44.3 51.26,46.84 51.26,53.09 51.66,53.49 51.66,54.86 52.68,55.88 U$1.34
  Bottom 0.203: v48.72,44.3 v28.4,44.3
N$16
  Top 0.203: R8.1 12.7,96.83 9.09,93.22 9.09,90.37 9.3,90.17 14.17,90.17 14.17,88.44 20.73,81.89 24.59,81.89 24.59,82.86 25.04,83.31 26.92,83.31 26.92,80.16 IC1.17
N$17
  Top 0.203: R9.1 17.78,95.56 17.78,93.02 20.62,90.17 R49.1 20.73,90.22 20.73,91.24 26.82,91.24 27.64,90.42 27.64,80.16 IC1.16
N$18
  Top 0.203: R10.1 22.86,96.83 28.25,91.44 28.25,80.16 IC1.15
N$19  (via drill 0.38)
  Top 0.203: v13.97,18.69 8.89,18.69 R3.1 | 22.2,17.63 v20.73,17.63 | 22.2,17.63 22.2,18.03 U$3.1 | U$4.4 22.25,16.51 22.25,17.58 22.2,17.63
  Bottom 0.203: v13.97,18.69 15.04,17.63 v20.73,17.63
N$20  (via drill 0.38)
  Top 0.203: v13.01,21.89 8.89,21.89 R4.1 | U$3.2 22.25,18.75 23.27,18.75 v23.82,19.3 23.67,19.05 U$4.3
  Bottom 0.203: v13.01,21.89 15.6,19.3 v23.82,19.3
N$21
  Top 0.203: R5.1 20.02,12.7 20.02,18.09 21.29,19.36 22.2,19.36 U$3.3
N$22
  Top 0.203: R8.2 12.7,98.75 14.73,100.79 14.73,103.02 U$6.P$5
N$23
  Top 0.203: R6.1 8.89,26.98 14.53,21.34 14.53,19.1 14.88,18.75 15.85,18.75 U$3.7
N$24  (via drill 0.38)
  Top 0.203: v31.85,45.01 31.85,44.3 30.12,44.3 U$2.2 | v51.36,45.67 51.66,45.97 51.66,52.32 52.68,53.34 U$1.32
  Bottom 0.203: v31.85,45.01 32.51,45.67 v51.36,45.67
N$25  (via drill 0.38)
  Top 0.203: v39.93,39.98 38.1,38.15 38.1,30.48 ESTOP.P$1
  Bottom 0.203: v39.93,39.98 46.94,39.98 52.68,45.72 U$1.26
N$26
  Top 0.61: D1.C 132.08,47.39 IC4.12 132.08,37.02 L1.P$1
N$27
  Top 0.61: BRAKE.P$1 138.43,62.27 U$13.3
N$28
  Top 0.203: U$13.1 136.14,57.4 135.03,57.4 132.08,54.46 Q1.3 132.03,54.36 132.03,53.7 121.92,53.7 R57.2
N$36
  Top 0.203: R9.2 17.78,97.48 U$6.P$8
N$37
  Top 0.203: R10.2 22.86,98.75 20.83,100.79 20.83,103.02 U$6.P$11
N$38
  Top 0.203: R11.2 20.32,97.48 19.81,97.99 19.81,103.02 U$6.P$10
N$39
  Top 0.203: R14.2 38.1,97.48 38.61,97.99 38.61,103.02 U$7.P$6
N$40
  Top 0.203: R14.1 38.1,95.61 39.57,95.61 39.57,96.32 39.78,96.52 43.18,96.52 43.18,95.61 R18.1 43.18,95.5 43.18,91.14 R20.2 43.23,91.14 48.26,91.14 R19.2
N$41
  Top 0.203: R17.1 45.72,96.83 49.33,93.22 49.33,90.37 49.12,90.17 38.71,90.17 38.71,87.99 30.89,80.16 IC1.11
N$42
  Top 0.203: R16.1 40.64,95.56 40.64,93.02 37.8,90.17 R50.1 37.69,90.12 30.43,82.86 30.43,80.37 30.23,80.16 IC1.12
N$43
  Top 0.203: R15.1 35.56,96.83 29.67,90.93 29.67,80.26 29.57,80.16 IC1.13
N$44  (via drill 0.38)
  Top 0.203: v35.87,81.89 43.18,89.2 R20.1 | v28.96,81.89 28.96,80.16 IC1.14
  Bottom 0.203: v28.96,81.89 v35.87,81.89
N$45
  Top 0.203: R21.2 106.68,97.48 107.19,97.99 107.19,103.02 U$8.P$6
N$46
  Top 0.203: R26.2 101.6,91.14 106.68,91.14 R27.2 106.68,91.19 106.68,95.56 R21.1 106.73,95.66 106.73,96.52 110.08,96.52 110.29,96.32 110.29,95.61 111.76,95.61 R25.1
N$47
  Top 0.203: R27.1 106.68,89.2 110.54,85.34 110.54,75.18 112.93,72.8 116.99,72.8 116.99,81.53 118.06,82.6 119.02,82.6 119.02,80.16 IC2.18
N$48  (via drill 0.38)
  Top 0.203: v105.31,95.66 104.14,96.83 R22.1 | v118.87,83.31 119.63,82.55 119.63,80.16 IC2.17
  Bottom 0.203: v105.31,95.66 117.65,83.31 v118.87,83.31
N$49
  Top 0.203: R23.1 109.22,95.56 109.22,93.02 112.06,90.17 R51.1 112.17,90.22 112.17,91.24 114.76,91.24 120.14,85.85 120.14,80.31 120.29,80.16 IC2.16
N$50
  Top 0.203: R24.1 114.3,96.83 120.85,90.27 120.85,80.26 120.95,80.16 IC2.15
N$51
  Top 0.203: R22.2 104.14,98.75 106.17,100.79 106.17,103.02 U$8.P$5
N$52
  Top 0.203: R23.2 109.22,97.48 U$8.P$8
N$53
  Top 0.203: R24.2 114.3,98.75 112.27,100.79 112.27,103.02 U$8.P$11
N$54
  Top 0.203: R25.2 111.76,97.48 111.25,97.99 111.25,103.02 U$8.P$10
N$55
  Top 0.203: R28.2 129.54,97.48 130.05,97.99 130.05,103.02 U$9.P$6
N$56
  Top 0.203: R28.1 129.54,95.61 131.01,95.61 131.01,96.32 131.22,96.52 134.57,96.52 134.57,95.66 R32.1 134.62,95.56 134.62,91.14 R34.2 134.67,91.14 139.7,91.14 R33.2
N$57
  Top 0.203: R31.1 137.16,96.83 140.77,93.22 140.77,88.44 134.62,82.3 123.6,82.3 123.6,80.16 IC2.11
N$58
  Top 0.203: R30.1 132.08,95.56 132.08,93.02 129.24,90.17 R52.1 129.13,90.12 123.14,84.12 123.14,80.37 122.94,80.16 IC2.12
N$59
  Top 0.203: R29.1 127,96.83 122.28,92.1 122.28,80.16 IC2.13
N$60  (via drill 0.38)
  Top 0.203: v130.45,89.2 134.62,89.2 R34.1 | v121.56,82.6 121.61,82.55 121.61,80.16 IC2.14
  Bottom 0.203: v130.45,89.2 123.85,82.6 v121.56,82.6
N$61
  Top 0.203: R35.2 60.96,97.48 61.47,97.99 61.47,103.02 U$10.P$6
N$62
  Top 0.203: R40.2 55.88,91.08 59.28,91.08 59.33,91.03 60.96,91.03 60.96,91.08 R41.2 60.96,91.19 60.96,95.56 R35.1 61.01,95.66 61.01,96.52 64.36,96.52 64.57,96.32 64.57,95.61 66.04,95.61 R39.1
N$63
  Top 0.203: R41.1 60.96,89.2 65.48,89.2 74.62,80.06 77.11,80.06 77.11,77.62 IC3.18
N$64  (via drill 0.38)
  Top 0.203: v90.27,95.15 90.27,95.66 91.44,96.83 R45.1 | v81.53,86.41 81.84,86.11 81.84,77.78 81.69,77.62 IC3.11
  Bottom 0.203: v81.53,86.41 v90.27,95.15
N$65  (via drill 0.38)
  Top 0.203: v59.59,91.75 59.59,95.66 58.42,96.83 R36.1 | v77.11,75.84 77.72,76.45 77.72,77.57 IC3.17
  Bottom 0.203: v59.59,91.75 75.49,75.84 v77.11,75.84
N$66
  Top 0.203: R37.1 63.5,95.56 63.5,93.02 66.34,90.17 R54.1 66.45,90.12 66.45,89.1 68.63,89.1 78.23,79.5 78.23,77.78 78.38,77.62 IC3.16
N$67
  Top 0.203: R36.2 58.42,98.75 60.45,100.79 60.45,103.02 U$10.P$5
N$68
  Top 0.203: R37.2 63.5,97.48 U$10.P$8
N$69
  Top 0.203: R38.2 68.58,98.75 66.55,100.79 66.55,103.02 U$10.P$11
N$70
  Top 0.203: R39.2 66.04,97.48 65.53,97.99 65.53,103.02 U$10.P$10
N$71
  Top 0.203: R42.2 83.82,97.48 84.33,97.99 84.33,103.02 U$11.P$6
N$72
  Top 0.203: R42.1 83.82,95.61 85.29,95.61 85.29,96.32 85.5,96.52 88.85,96.52 88.85,95.66 R46.1 88.9,95.56 88.9,91.14 R48.2 88.95,91.14 93.98,91.14 R47.2
N$73
  Top 0.203: R38.1 68.58,96.83 78.99,86.41 78.99,77.67 79.05,77.62 IC3.15
N$74  (via drill 0.38)
  Top 0.203: R44.1 86.36,95.56 86.36,93.02 83.52,90.17 R53.1 83.41,90.12 83.41,87.33 v82.96,86.87 | v81.13,85.04 81.13,77.72 81.03,77.62 IC3.12
  Bottom 0.203: v82.96,86.87 v81.13,85.04
N$75
  Top 0.203: R43.1 81.28,96.83 80.42,95.96 80.42,77.67 80.37,77.62 IC3.13
N$76  (via drill 0.38)
  Top 0.203: v82.96,82.6 82.96,83.26 88.9,89.2 R48.1 | v79.7,79.35 79.7,77.62 IC3.14
  Bottom 0.203: v79.7,79.35 v82.96,82.6
N$77
  Top 0.203: R45.2 91.44,98.75 89.41,100.79 89.41,103.02 U$11.P$11
N$78
  Top 0.203: R44.2 86.36,97.48 U$11.P$8
N$79
  Top 0.203: R43.2 81.28,98.75 83.31,100.79 83.31,103.02 U$11.P$5
N$80
  Top 0.203: R46.2 88.9,97.48 88.39,97.99 88.39,103.02 U$11.P$10
N$81
  Top 0.203: R18.2 43.18,97.48 42.67,97.99 42.67,103.02 U$7.P$10
N$82
  Top 0.203: R17.2 45.72,98.75 43.69,100.79 43.69,103.02 U$7.P$11
N$83
  Top 0.203: R16.2 40.64,97.48 U$7.P$8
N$84
  Top 0.203: R15.2 35.56,98.75 37.59,100.79 37.59,103.02 U$7.P$5
N$85
  Top 0.203: R32.2 134.62,97.48 134.11,97.99 134.11,103.02 U$9.P$10
N$86
  Top 0.203: R31.2 137.16,98.75 135.13,100.79 135.13,103.02 U$9.P$11
N$87
  Top 0.203: R30.2 132.08,97.48 U$9.P$8
N$88
  Top 0.203: R29.2 127,98.75 129.03,100.79 129.03,103.02 U$9.P$5
OUT-0A  (via drill 0.6)
  Top 0.61: U$9.P$16 139.1,127 M0-CONN3.P$2
  other vias: 138.43,115.57 138.43,118.11 137.16,116.84 135.89,118.11 135.89,115.57
  pour Top: 138.43,116.84 140.97,116.84 140.97,124.46 142.24,124.46 142.24,114.3 138.43,114.3
  pour Bottom: 133.35,124.46 142.24,124.46 142.24,114.3 133.35,114.3
OUT-0B  (via drill 0.6)
  Top 0.61: U$9.P$25 130.1,126.9 M0-CONN3.P$1
  other vias: 128.27,118.11 128.27,115.57 127,116.84 125.73,118.11 125.73,115.57
  pour Top: 128.27,114.3 121.92,114.3 121.92,124.46 123.19,124.46 123.19,116.84 128.27,116.84
  pour Bottom: 121.92,124.46 130.81,124.46 130.81,114.3 121.92,114.3
OUT-1A  (via drill 0.6)
  Top 0.61: U$8.P$21 111.2,129.7 M0-CONN2.P$2
  other vias: 115.57,118.11 114.3,116.84 113.03,118.11 113.03,115.57 115.57,115.57
  pour Top: 111.76,116.84 118.11,116.84 118.11,124.46 119.38,124.46 119.38,114.3 111.76,114.3
  pour Bottom: 110.49,124.46 119.38,124.46 119.38,114.3 110.49,114.3
OUT-1B  (via drill 0.6)
  Top 0.61: U$8.P$30 102.2,126.9 M0-CONN2.P$1
  other vias: 102.87,115.57 105.41,115.57 104.14,116.84 105.41,118.11 102.87,118.11
  pour Top: 105.41,116.84 100.33,116.84 100.33,124.46 99.06,124.46 99.06,114.3 105.41,114.3
  pour Bottom: 99.06,124.46 107.95,124.46 107.95,114.3 99.06,114.3
OUT-2A  (via drill 0.6)
  Top 0.61: U$11.P$16 93.4,126.9 M0-CONN5.P$2
  other vias: 92.71,118.11 90.17,118.11 91.44,116.84 90.17,115.57 92.71,115.57
  pour Top: 88.9,116.84 95.25,116.84 95.25,124.46 96.52,124.46 96.52,114.3 88.9,114.3
  pour Bottom: 87.63,114.3 96.52,114.3 96.52,124.46 87.63,124.46
OUT-2B  (via drill 0.6)
  Top 0.61: U$11.P$25 84.4,127.5 M0-CONN5.P$1
  other vias: 82.55,118.11 80.01,118.11 81.28,116.84 82.55,115.57 80.01,115.57
  pour Top: 81.28,116.84 77.47,116.84 77.47,124.46 76.2,124.46 76.2,114.3 81.28,114.3
  pour Bottom: 76.2,114.3 85.09,114.3 85.09,124.46 76.2,124.46
OUT-3A  (via drill 0.6)
  Top 0.61: U$10.P$21 65.5,127.6 M0-CONN4.P$2
  other vias: 69.85,118.11 69.85,115.57 68.58,116.84 67.31,118.11 67.31,115.57
  pour Top: 66.04,116.84 72.39,116.84 72.39,124.46 73.66,124.46 73.66,114.3 66.04,114.3
  pour Bottom: 64.77,114.3 73.66,114.3 73.66,124.46 64.77,124.46
OUT-3B  (via drill 0.6)
  Top 0.61: U$10.P$30 56.5,126.7 M0-CONN4.P$1
  other vias: 59.69,118.11 59.69,115.57 58.42,116.84 57.15,118.11 57.15,115.57
  pour Top: 58.42,114.3 53.34,114.3 53.34,124.46 54.61,124.46 54.61,116.84 58.42,116.84
  pour Bottom: 62.23,114.3 53.34,114.3 53.34,124.46 62.23,124.46
OUT-4A  (via drill 0.6)
  Top 0.61: U$7.P$16 47.7,128.2 M0-CONN1.P$2
  other vias: 46.99,118.11 46.99,115.57 45.72,116.84 44.45,118.11 44.45,115.57
  pour Top: 43.18,116.84 49.53,116.84 49.53,124.46 50.8,124.46 50.8,114.3 43.18,114.3
  pour Bottom: 41.91,114.3 50.8,114.3 50.8,124.46 41.91,124.46
OUT-4B  (via drill 0.6)
  Top 0.61: U$7.P$25 38.7,128.2 M0-CONN1.P$1
  other vias: 36.83,118.11 36.83,115.57 35.56,116.84 34.29,118.11 34.29,115.57
  pour Top: 36.83,114.3 30.48,114.3 30.48,124.46 31.75,124.46 31.75,116.84 36.83,116.84
  pour Bottom: 39.37,114.3 30.48,114.3 30.48,124.46 39.37,124.46
OUT-5A  (via drill 0.6)
  Top 0.61: U$6.P$21 19.7,128 M0-CONN.P$2
  other vias: 24.13,115.57 24.13,118.11 22.86,116.84 21.59,118.11 21.59,115.57
  pour Top: 22.86,116.84 26.67,116.84 26.67,124.46 27.94,124.46 27.94,114.3 22.86,114.3
  pour Bottom: 19.05,114.3 27.94,114.3 27.94,124.46 19.05,124.46
OUT-5B  (via drill 0.6)
  Top 0.61: U$6.P$30 10.8,128.6 M0-CONN.P$1
  other vias: 13.97,115.57 13.97,118.11 12.7,116.84 11.43,115.57 11.43,118.11
  pour Top: 11.43,116.84 8.89,116.84 8.89,124.46 7.62,124.46 7.62,114.3 11.43,114.3
  pour Bottom: 16.51,114.3 7.62,114.3 7.62,124.46 16.51,124.46
Q0-A
  Bottom 0.203: JP1.3 12.5,41.91 12.5,38.05 21.84,28.7 22.35,28.7 26.42,32.77 45.87,32.77 51.77,26.87 53.75,26.87 53.75,24.33 55.22,22.86 U$1.7
Q0-B  (via drill 0.38)
  Top 0.203: v9.96,35.87 9.96,40.84 JP1.4
  Bottom 0.203: v9.96,35.87 18.03,27.79 47.75,27.79 52.68,22.86 U$1.8
Q0-I  (via drill 0.38)
  Top 0.203: v46.28,38.46 49.84,34.9 49.84,34.49 52.73,34.49 53.75,33.48 53.75,26.87 55.22,25.4 U$1.9
  Bottom 0.203: v46.28,38.46 45.97,38.76 35.46,38.76 31.04,43.18 12.7,43.18 JP1.5
Q1-A
  Bottom 0.203: JP1.6 7.82,44.45 7.82,38.96 18.59,28.19 49.89,28.19 52.68,25.4 U$1.10
Q1-B  (via drill 0.38)
  Top 0.203: v18.69,40.89 13.51,46.08 13.51,46.89 13.06,47.35 11.43,47.35 JP1.7
  Bottom 0.203: v18.69,40.89 23.62,35.97 52.27,35.97 52.68,35.56 U$1.18
Q1-I  (via drill 0.38)
  Top 0.203: v39.17,54.81 v42.52,51.46
  Bottom 0.203: v42.52,51.46 52.02,51.46 52.68,50.8 U$1.30 | v39.17,54.81 38.3,55.68 11.02,55.68 9.96,54.61 9.96,50.6 8.48,50.6 7.82,49.94 7.82,46.99 JP1.8
Q2-A  (via drill 0.38)
  Top 0.203: v20.12,47.35 19.81,47.04 19.81,41.71 20.78,41.71 21.23,42.16 21.23,44.76 23.22,44.76 U$2.46
  Bottom 0.203: v20.12,47.35 20.07,47.4 13.56,47.4 JP1.9
Q2-B  (via drill 0.38)
  Top 0.203: v21.49,45.92 21.49,45.82 23.22,45.82 U$2.44
  Bottom 0.203: v21.49,45.92 11.02,45.92 9.96,46.99 9.96,49.53 JP1.10
Q2-I  (via drill 0.38)
  Top 0.203: v21.03,52.73 23.22,52.73 U$2.30
  Bottom 0.203: v21.03,52.73 20.37,52.07 JP1.11
Q3-A  (via drill 0.38)
  Top 0.203: v24.94,45.92 24.94,46.28 23.27,46.28 U$2.43
  Bottom 0.203: v24.94,45.92 24.23,45.21 12.14,45.21 11.84,45.52 8.74,45.52 7.42,46.84 7.42,52.07 JP1.12
Q3-B  (via drill 0.38)
  Top 0.203: v25.65,54.2 25.65,52.32 25.55,52.22 25.55,51.87 24.69,51.87 24.64,51.82 23.27,51.82 U$2.32
  Bottom 0.203: v25.65,54.2 25.25,54.61 JP1.13
Q3-I  (via drill 0.38)
  Top 0.203: v25.09,47.45 25.09,47.3 23.27,47.3 U$2.41 | v16.87,48.11 11.43,53.54 8.89,53.54 JP1.14
  Bottom 0.203: v25.09,47.45 24.43,48.11 v16.87,48.11
Q4-A  (via drill 0.38)
  Top 0.203: v15.8,57.15 15.8,57 21.03,51.77 21.03,51.31 23.22,51.31 U$2.33
  Bottom 0.203: JP1.15 v15.8,57.15
Q4-B  (via drill 0.38)
  Top 0.203: v24.94,48.56 24.94,48.26 24.49,47.8 23.27,47.8 U$2.40 | v17.98,49.53 11.43,56.08 8.89,56.08 JP1.16
  Bottom 0.203: v24.94,48.56 23.98,49.53 v17.98,49.53
Q4-I  (via drill 0.38)
  Top 0.203: v13.21,59.18 13.21,58.78 20.62,51.36 20.62,50.29 23.22,50.29 U$2.35
  Bottom 0.203: v13.21,59.18 12.7,59.69 JP1.17
Q5-A
  Top 0.203: JP1.18 8.89,58.62 11.53,58.62 19.81,50.34 19.81,48.82 23.22,48.82 U$2.38
Q5-B  (via drill 0.38)
  Top 0.203: v25.4,49.78 23.27,49.78 U$2.36 | v26.92,52.38 26.36,52.93 26.36,54.46 v23.98,56.84
  Bottom 0.203: v25.4,49.78 26.92,51.31 v26.92,52.38 | v23.98,56.84 18.59,62.23 JP1.19
Q5-I
  Top 0.203: JP1.20 8.89,61.16 11.43,61.16 12.5,60.1 12.5,58.93 20.22,51.21 20.22,49.33 23.22,49.33 U$2.37
VCC  (via drill 0.38)
  Top 0.203: 19.15,80.21 19.2,80.16 20.32,80.16 C1.1 20.37,80.16 24.99,80.16 IC1.20 24.99,80.26 25.2,80.47 25.2,82.5 v25.3,82.6 | 19.15,80.21 10.16,89.2 R12.1 | R55.2 13.66,71.12 19.1,76.56 19.1,80.16 19.15,80.21 | 75.79,78.84 66.04,78.84 C2.1 65.99,78.94 65.99,79.1 55.93,89.15 R40.1 55.88,89.26 48.26,89.26 R19.1 48.21,89.15 v47.14,88.09 | 75.79,78.84 75.79,77.62 IC3.20 | 115.12,27.9 114.96,28.14 114.96,38.41 120.75,44.2 120.75,54.36 121.92,55.52 R57.1 121.97,55.63 124.16,57.81 v124.16,78.59 | v135.99,89.2 139.7,89.2 R33.1 | v118.31,81.89 117.75,81.33 117.75,80.16 IC2.20 | v113.28,78.89 111.76,78.89 C3.1 111.71,78.94 111.15,79.5 111.15,90.17 105.82,90.17 105.61,89.97 105.61,89.31 101.65,89.31 R26.1 101.6,89.26 93.98,89.26 R47.1 93.93,89.15 v89.1,84.33 | v76.3,79.35 75.84,78.89 75.79,78.84
  Top 0.61: IC4.3 132.08,25.4 | 132.08,25.4 C11.+ | 132.08,25.4 132.08,29.02 L1.P$2 115.12,27.9 U$1.51 U$1.52
  Bottom 0.203: v25.3,82.6 30.79,88.09 v47.14,88.09 | v135.99,89.2 128.68,81.89 124.16,81.89 | 124.16,81.89 v118.31,81.89 118.26,81.84 116.23,81.84 v113.28,78.89 | v124.16,78.59 124.16,81.84 124.16,81.89 | v76.3,79.35 81.28,84.33 v89.1,84.33

## Text on the board
tPlace: B | 5 | A | B | 4 | A | B | 3 | A | B | 2 | A | B | 1 | A | B | 0 | A | GND | +24V | BRAKE | +3v3 | 1 | STOP | Quadrature inputs | SERVITRON SIX | 6-AXIS DC SERVO DRIVER BOARD / JUL2013ROTM VERSION ONE / Licensed under CERN OHL v1.1.1